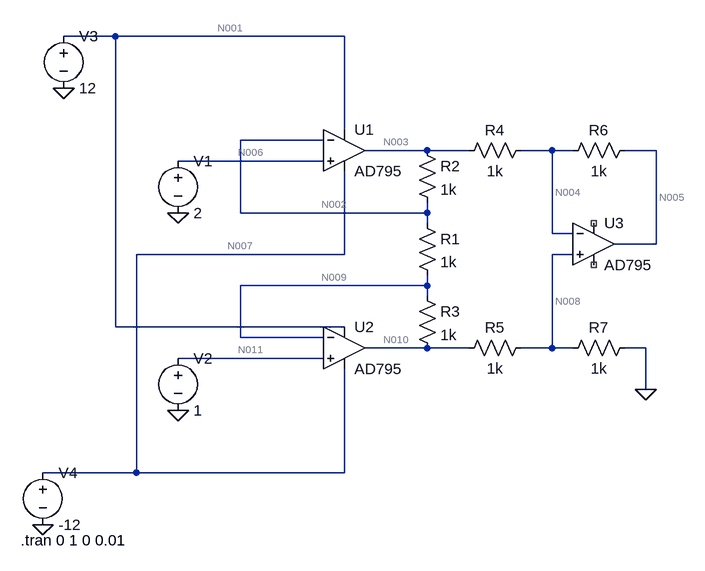
[diagram p0: schematic instrument voltage difference amplifier.asc]
instrument voltage difference amplifier.asc, the LTspice schematic file:
Version 4
SHEET 1 880 680
WIRE -272 -112 -352 -112
WIRE 80 -112 -272 -112
WIRE 80 32 80 -112
WIRE 48 48 -80 48
WIRE 208 64 112 64
WIRE 272 64 208 64
WIRE 400 64 352 64
WIRE 432 64 400 64
WIRE 560 64 512 64
WIRE 48 80 -176 80
WIRE -80 160 -80 48
WIRE 208 160 208 144
WIRE 208 160 -80 160
WIRE 208 176 208 160
WIRE 400 192 400 64
WIRE 432 192 400 192
WIRE 560 208 560 64
WIRE 560 208 496 208
WIRE 80 224 80 96
WIRE 80 224 -240 224
WIRE 432 224 400 224
WIRE 208 272 208 256
WIRE 208 272 -80 272
WIRE 208 288 208 272
WIRE -272 336 -272 -112
WIRE 80 336 -272 336
WIRE -80 352 -80 272
WIRE 48 352 -80 352
WIRE 208 368 112 368
WIRE 272 368 208 368
WIRE 400 368 400 224
WIRE 400 368 352 368
WIRE 432 368 400 368
WIRE 544 368 512 368
WIRE 48 384 -176 384
WIRE 544 432 544 368
WIRE -240 560 -240 224
WIRE -240 560 -384 560
WIRE 80 560 80 400
WIRE 80 560 -240 560
FLAG -176 160 0
FLAG -176 464 0
FLAG -384 640 0
FLAG -352 -32 0
FLAG 544 432 0
SYMBOL Opamps\\AD795 80 0 R0
SYMATTR InstName U1
SYMBOL Opamps\\AD795 80 304 R0
SYMATTR InstName U2
SYMBOL Opamps\\AD795 464 144 R0
SYMATTR InstName U3
SYMBOL res 192 160 R0
SYMATTR InstName R1
SYMATTR Value 1k
SYMBOL res 192 48 R0
SYMATTR InstName R2
SYMATTR Value 1k
SYMBOL res 192 272 R0
SYMATTR InstName R3
SYMATTR Value 1k
SYMBOL res 368 48 R90
WINDOW 0 0 56 VBottom 2
WINDOW 3 32 56 VTop 2
SYMATTR InstName R4
SYMATTR Value 1k
SYMBOL res 368 352 R90
WINDOW 0 0 56 VBottom 2
WINDOW 3 32 56 VTop 2
SYMATTR InstName R5
SYMATTR Value 1k
SYMBOL res 528 48 R90
WINDOW 0 0 56 VBottom 2
WINDOW 3 32 56 VTop 2
SYMATTR InstName R6
SYMATTR Value 1k
SYMBOL res 528 352 R90
WINDOW 0 0 56 VBottom 2
WINDOW 3 32 56 VTop 2
SYMATTR InstName R7
SYMATTR Value 1k
SYMBOL voltage -176 64 R0
WINDOW 123 0 0 Left 2
WINDOW 39 0 0 Left 2
SYMATTR InstName V1
SYMATTR Value 2
SYMBOL voltage -176 368 R0
WINDOW 123 0 0 Left 2
WINDOW 39 0 0 Left 2
SYMATTR InstName V2
SYMATTR Value 1
SYMBOL voltage -352 -128 R0
WINDOW 123 0 0 Left 2
WINDOW 39 0 0 Left 2
SYMATTR InstName V3
SYMATTR Value 12
SYMBOL voltage -384 544 R0
WINDOW 123 0 0 Left 2
WINDOW 39 0 0 Left 2
SYMATTR InstName V4
SYMATTR Value -12
TEXT -418 664 Left 2 !.tran 0 1 0 0.01

The netlist it stands for:
* instrument voltage difference amplifier.asc
XU1 N006 N002 N001 N007 N003 AD795  ; pins In+ In- V+ V- OUT
XU2 N011 N009 N001 N007 N010 AD795  ; pins In+ In- V+ V- OUT
XU3 N008 N004 NC_01 NC_02 N005 AD795  ; pins In+ In- V+ V- OUT
R1 N002 N009 1k
R2 N003 N002 1k
R3 N009 N010 1k
R4 N004 N003 1k
R5 N008 N010 1k
R6 N005 N004 1k
R7 0 N008 1k
V1 N006 0 2
V2 N011 0 1
V3 N001 0 12
V4 N007 0 -12
.tran 0 1 0 0.01
.lib ADI1.lib
.backanno
.end

* Results of the author's LTspice run, read from the files saved beside the schematic
* Operating Point, zero values left out:
*   V(n007) = -12 V
*   V(n006) = 2 V
*   V(n002) = 2 V
*   V(n001) = 12 V
*   V(n003) = 3 V
*   V(n011) = 1 V
*   V(n009) = 1 V
*   V(n010) = 54.63 µV
*   V(n008) = 27.32 µV
*   V(n004) = 2.545 mV
*   V(n005) = -2.995 V
*   I(R7) = -27.32 nA
*   I(R6) = -2.998 mA
*   I(R5) = -27.31 nA
*   I(R4) = -2.998 mA
*   I(R3) = 1 mA
*   I(R2) = 1 mA
*   I(R1) = 1 mA
*   I(V4) = 3.552 mA
*   I(V3) = -6.55 mA
*   I(V2) = 11.9 pA
*   I(V1) = 12.9 pA
*   Ix(u1:1) = -12.9 pA
*   Ix(u1:2) = -13.1 pA
*   Ix(u1:99) = 5.27 mA
*   Ix(u1:50) = -1.273 mA
*   Ix(u1:30) = -3.998 mA
*   Ix(u2:1) = -11.9 pA
*   Ix(u2:2) = -12.1 pA
*   Ix(u2:99) = 1.279 mA
*   Ix(u2:50) = -2.279 mA
*   Ix(u2:30) = 1 mA
*   Ix(u3:1) = -4.664 pA
*   Ix(u3:2) = -4.867 pA
*   Ix(u3:30) = 2.998 mA
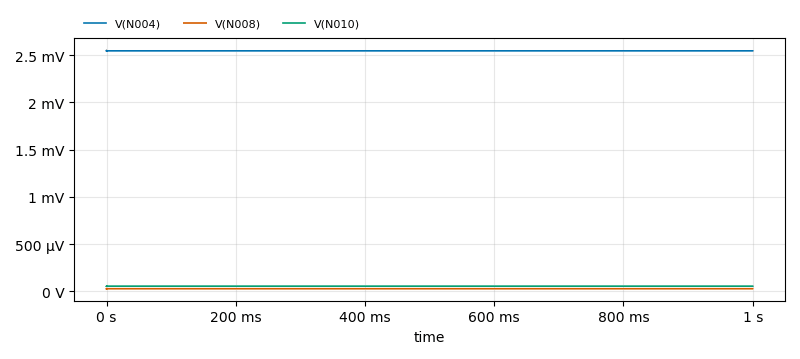
[diagram p1: Transient Analysis of instrument voltage difference amplifier.asc, plotted from the saved traces]
* Transient Analysis, 1 run:
*   V(N004): min 2.545 mV, max 2.55 mV, average 2.545 mV, rms 2.545 mV, last 2.545 mV
*   V(N008): min 26.53 µV, max 29.45 µV, average 27.32 µV, rms 27.32 µV, last 27.32 µV
*   V(N010): min 54.54 µV, max 54.94 µV, average 54.63 µV, rms 54.63 µV, last 54.63 µV